# EAGLE board SegmentDriver (EAGLE 7.7.0)
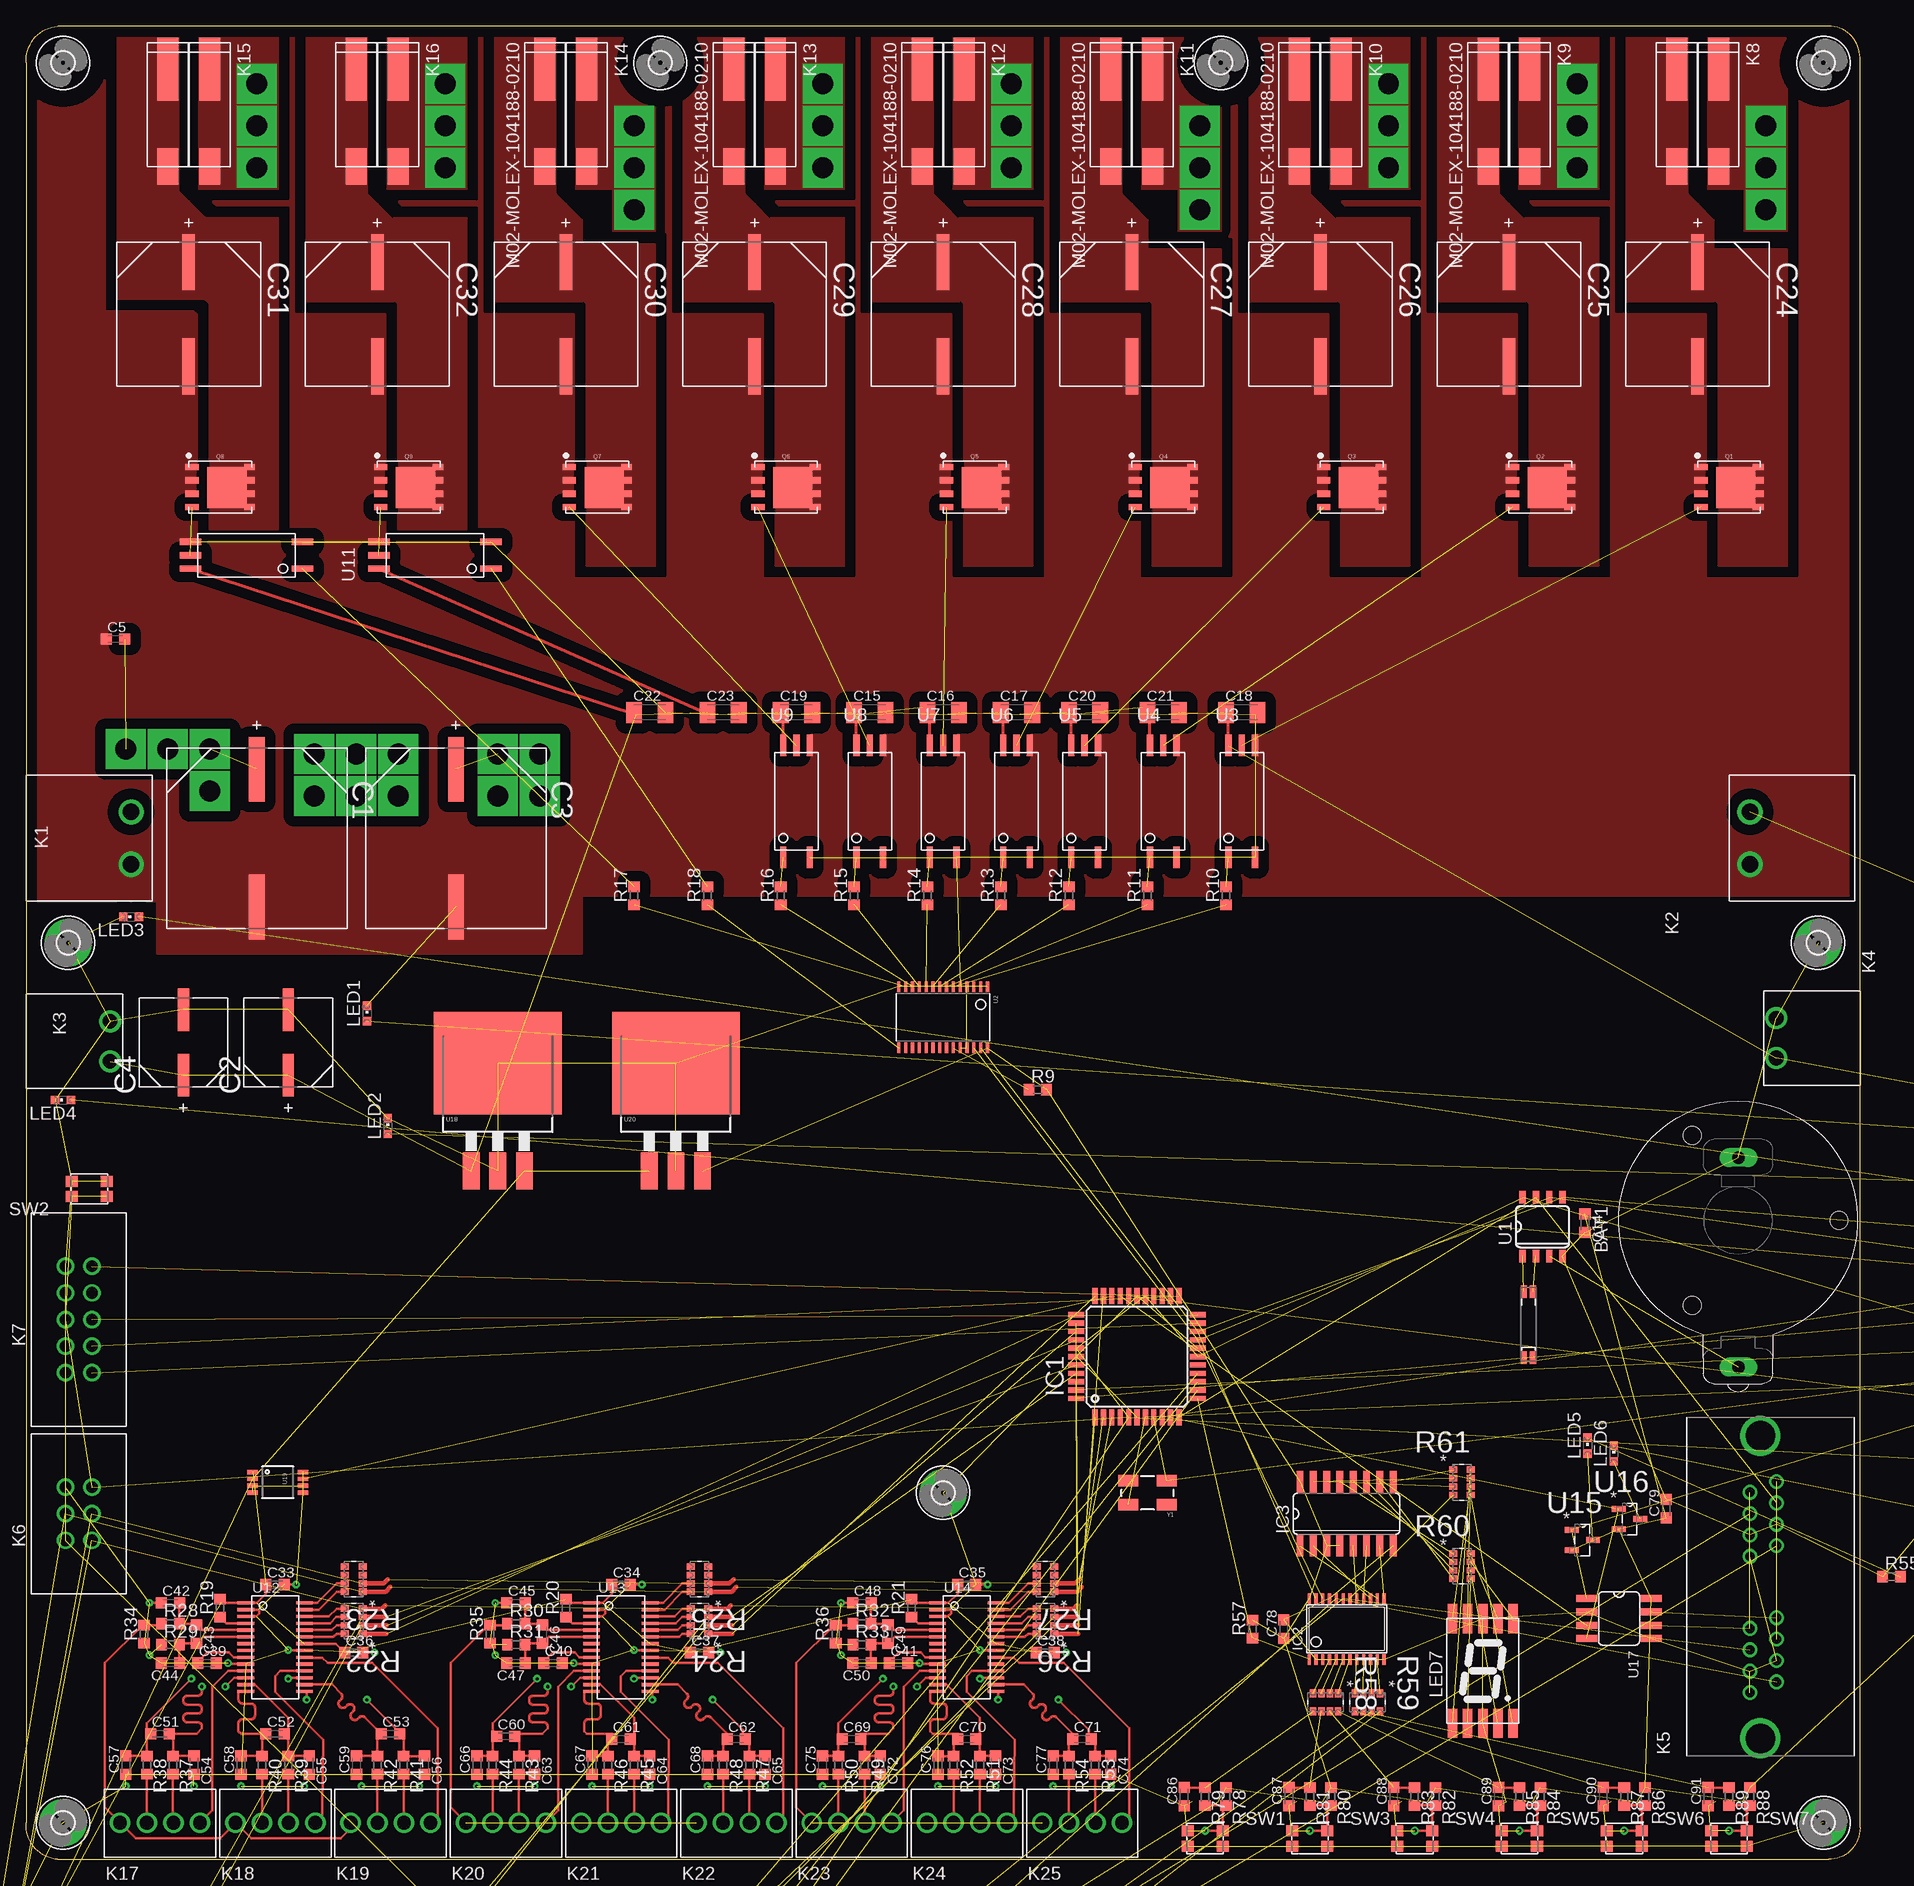
[diagram p10: board, top side]
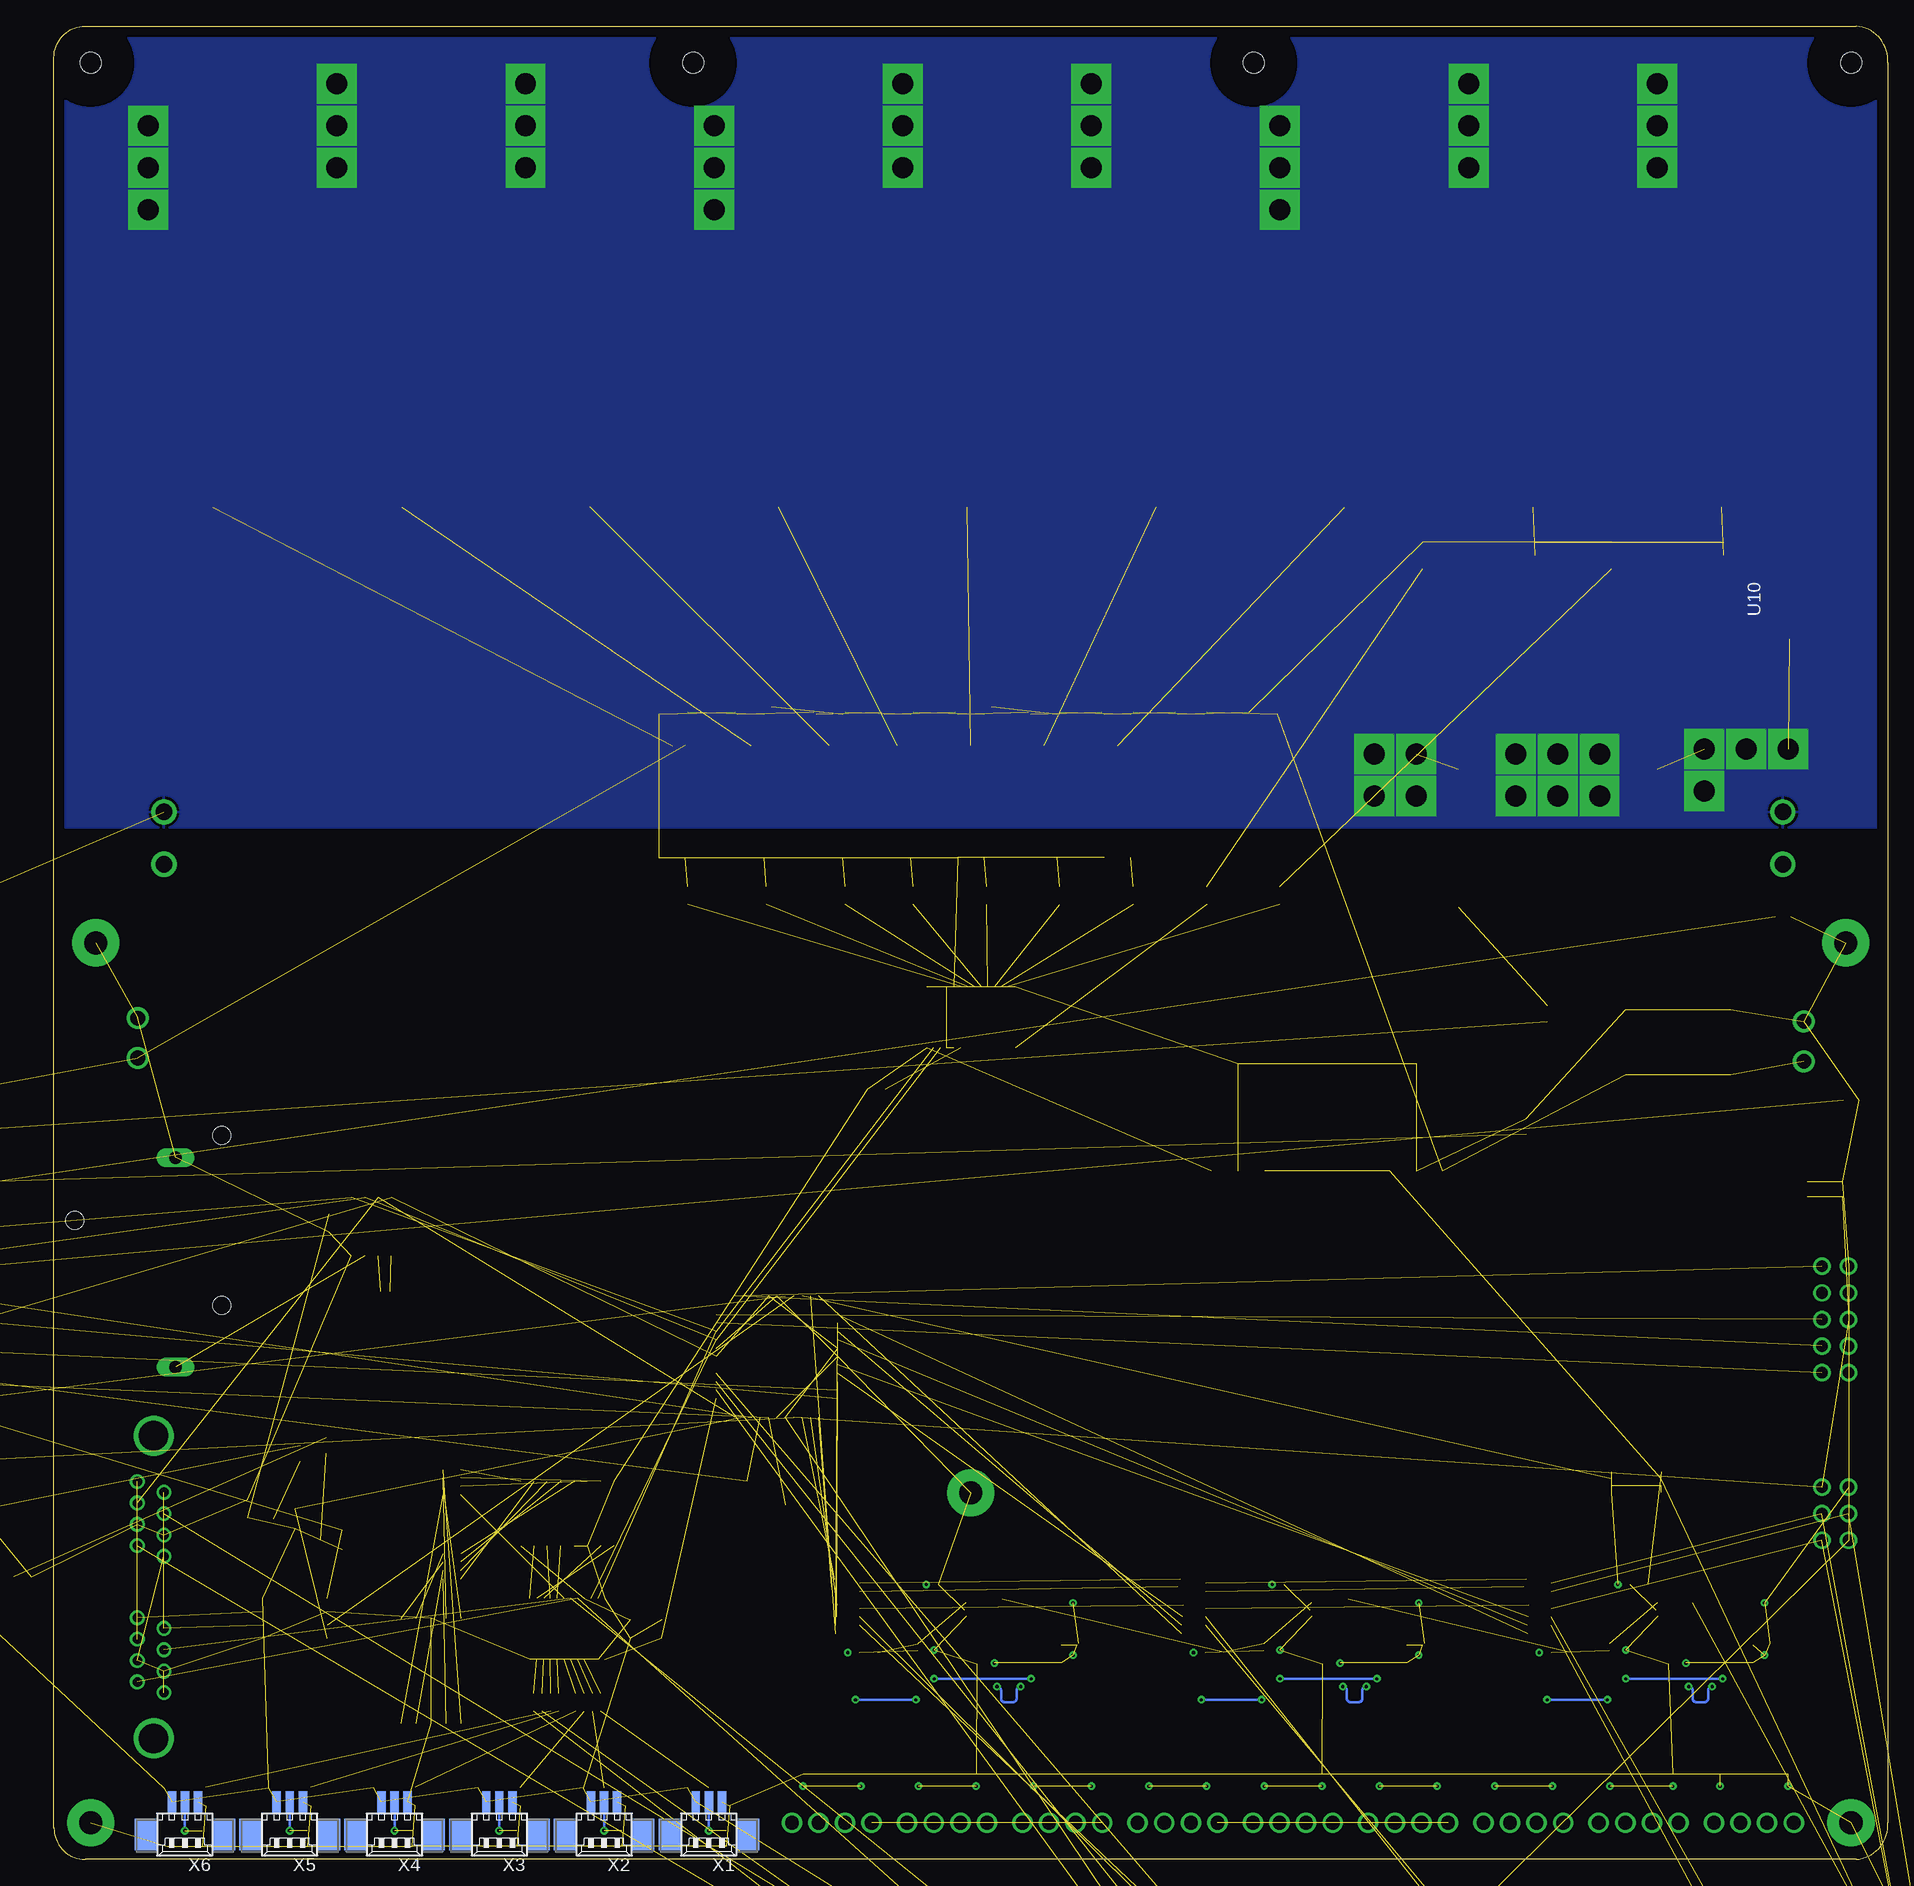
[diagram p11: board, bottom side, seen from below]

Size 175.01 x 175 mm. Coordinates in mm from the lower left corner, seen from the top.
Outline: 3.01,0 172.01,0 arc90 175.01,3 175.01,172 arc90 172.01,175 3.01,175 arc90 0.01,171.5 0.01,3.5 arc90 3.01,0
Copper layers (1*16): Top 0.035mm / dielectric 1.5mm / Bottom 0.035mm
Design rules "default": minimum track width 10mil, minimum drill 0.6mm, track to track 8mil, track to pad 8mil, pad to pad 8mil, via to via 8mil, smd to smd 8mil, copper to edge 40mil, drill to drill 8mil, minimum pad ring 10mil, minimum via ring 8mil, stop-mask expansion 4mil, vias tented up to drill 0mil, thermal gap 10mil
Net classes: 2 PWR: drill 0.4 mm

## Footprints (pad centres in the part's own frame; a part is rotated, then mirrored left to right if it is on the bottom)
2,0 = hole 2: 0,0
79528211 = drill 1.2 long: + -14,0; - 6,0 | hole 1.7: 0,-9.6; -8.1,4.4; 8.1,4.4
CAPAE1700X1700N = smd 6.172 x 1.499: 1 -6.579,0; 2 6.579,0
CAPAE830X1050N = smd 4.064 x 1.092: 1 -3.124,0; 2 3.124,0
C0603K = smd 1.05 x 1.08: 1 -0.875,0; 2 0.875,0
C1206K = smd 1.5 x 2: 1 -1.5,0; 2 1.5,0
CAPAE1350X1400N = smd 5.359 x 1.194: 1 -4.978,0; 2 4.978,0
C0805K = smd 1.3 x 1.6: 1 -1,0; 2 1,0
2,0-PAD = drill 2.2 pad 4.5: B2,2 0,0
TQFP44 = smd 1.5 x 0.5: 1 -5.8,4; 2 -5.8,3.2; 3 -5.8,2.4; 4 -5.8,1.6; 5 -5.8,0.8; 6 -5.8,0; 7 -5.8,-0.8; 8 -5.8,-1.6; 9 -5.8,-2.4; 10 -5.8,-3.2; 11 -5.8,-4; 23 5.8,-4; 24 5.8,-3.2; 25 5.8,-2.4; 26 5.8,-1.6; 27 5.8,-0.8; 28 5.8,0; 29 5.8,0.8; 30 5.8,1.6; 31 5.8,2.4; 32 5.8,3.2; 33 5.8,4 | smd 0.5 x 1.5: 12 -4,-5.8; 13 -3.2,-5.8; 14 -2.4,-5.8; 15 -1.6,-5.8; 16 -0.8,-5.8; 17 0,-5.8; 18 0.8,-5.8; 19 1.6,-5.8; 20 2.4,-5.8; 21 3.2,-5.8; 22 4,-5.8; 34 4,5.8; 35 3.2,5.8; 36 2.4,5.8; 37 1.6,5.8; 38 0.8,5.8; 39 0,5.8; 40 -0.8,5.8; 41 -1.6,5.8; 42 -2.4,5.8; 43 -3.2,5.8; 44 -4,5.8
TSSOP24 = smd 0.305 x 0.991: 1 -3.575,-2.918; 2 -2.925,-2.918; 3 -2.275,-2.918; 4 -1.625,-2.918; 5 -0.975,-2.918; 6 -0.325,-2.918; 7 0.325,-2.918; 8 0.975,-2.918; 9 1.625,-2.918; 10 2.275,-2.918; 11 2.925,-2.918; 12 3.575,-2.918; 13 3.575,2.918; 14 2.925,2.918; 15 2.275,2.918; 16 1.625,2.918; 17 0.975,2.918; 18 0.325,2.918; 19 -0.325,2.918; 20 -0.975,2.918; 21 -1.625,2.918; 22 -2.275,2.918; 23 -2.925,2.918; 24 -3.575,2.918
SO16 = smd 0.66 x 2.032: 1 -4.445,-3.073; 2 -3.175,-3.073; 3 -1.905,-3.073; 4 -0.635,-3.073; 5 0.635,-3.073; 6 1.905,-3.073; 7 3.175,-3.073; 8 4.445,-3.073; 9 4.445,3.073; 10 3.175,3.073; 11 1.905,3.073; 12 0.635,3.073; 13 -0.635,3.073; 14 -1.905,3.073; 15 -3.175,3.073; 16 -4.445,3.073
2X3 = drill 1.016 pad 1.88 octagon: 1 0,0; 2 0,2.54; 3 2.54,0; 4 2.54,2.54; 5 5.08,0; 6 5.08,2.54
691313710002 = drill 1.6: 1 -5,0; 2 0,0
691322310002 = drill 1.4: 1 -3.81,0; 2 0,0
615016149521 = drill 0.9: A1 -2.93,-1.54; A2 -3.95,1; A3 -4.97,-1.54; A4 -5.99,1; A5 -7.01,-1.54; A6 -8.03,1; A7 -9.05,-1.54; A8 -10.07,1; B1 10.07,-1.54; B2 9.05,1; B3 8.03,-1.54; B4 7.01,1; B5 5.99,-1.54; B6 4.97,1; B7 3.95,-1.54; B8 2.93,1 | drill 2.8: Z1 -14.45,0; Z2 14.45,0
61200621621 = drill 1.1: 1 -2.54,-1.27; 2 -2.54,1.27; 3 0,-1.27; 4 0,1.27; 5 2.54,-1.27; 6 2.54,1.27
61201021621 = drill 1.1: 1 -2.54,-1.27; 2 -2.54,1.27; 3 0,-1.27; 4 0,1.27; 5 2.54,-1.27; 6 2.54,1.27; 7 5.08,-1.27; 8 5.08,1.27; 9 7.62,-1.27; 10 7.62,1.27
LITE-TRAP-CONNECTOR-2 = smd 6 x 2: 1A -3.4,-2; 2A -3.4,2 | smd 3.5 x 2: 1B 5.9,-2; 2B 5.9,2
691210910004 = drill 1.3: 1 -2.54,0; 2 0,0; 3 2.54,0; 4 5.08,0
CHIPLED_0603 = smd 0.8 x 0.8: A 0,-0.75; C 0,0.75
SA02107 = smd 0.9 x 2.8: A@7 1.44,5; B@6 2.88,5; C@4 1.44,-5; COM@3 0,-5; COM@8 0,5; D@2 -1.44,-5; DP@5 2.88,-5; E@1 -2.88,-5; F@9 -1.44,5; G@10 -2.88,5
POWERPACK5060-8 = smd 1.02 x 0.61: D5 2.79,-1.905; D8 2.79,1.905 | smd 0.77 x 0.61: D6 2.915,-0.635; D7 2.915,0.635 | smd 3.75 x 3.91: DPAD 0.65,-0.05 | smd 1.27 x 0.61: G4 -2.675,-1.905; S1 -2.675,1.905; S2 -2.675,0.635; S3 -2.675,-0.635
R0603 = smd 1 x 1.1: 1 -0.85,0; 2 0.85,0
RESCAV80P320X160X70-8N = smd 0.762 x 0.61: 1 -0.838,1.194; 2 -0.838,0.406; 3 -0.838,-0.406; 4 -0.838,-1.194; 5 0.838,-1.194; 6 0.838,-0.406; 7 0.838,0.406; 8 0.838,1.194
434153017835 = smd 1.15 x 1.05: 1 -1.675,0.725; 2 -1.675,-0.725; 3 1.675,0.725; 4 1.675,-0.725
SO08-TIGHT = smd 0.6 x 1.2: 1 -1.905,-2.8; 2 -0.635,-2.8; 3 0.635,-2.8; 4 1.905,-2.8; 5 1.905,2.8; 6 0.635,2.8; 7 -0.635,2.8; 8 -1.905,2.8
TSSOP28 = smd 0.305 x 0.991: 1 -4.225,-2.918; 2 -3.575,-2.918; 3 -2.925,-2.918; 4 -2.275,-2.918; 5 -1.625,-2.918; 6 -0.975,-2.918; 7 -0.325,-2.918; 8 0.325,-2.918; 9 0.975,-2.918; 10 1.625,-2.918; 11 2.275,-2.918; 12 2.925,-2.918; 13 3.575,-2.918; 14 4.225,-2.918; 15 4.225,2.918; 16 3.575,2.918; 17 2.925,2.918; 18 2.275,2.918; 19 1.625,2.918; 20 0.975,2.918; 21 0.325,2.918; 22 -0.325,2.918; 23 -0.975,2.918; 24 -1.625,2.918; 25 -2.275,2.918; 26 -2.925,2.918; 27 -3.575,2.918; 28 -4.225,2.918
WB-SOP5 = smd 0.6 x 2.05: 1 -1.27,-5.35; 3 1.27,-5.35; 4 1.27,5.35; 5 0,5.35; 6 -1.27,5.35
TSSOP28' = smd 0.3 x 1.6: 1 -4.25,-2.8; 2 -3.6,-2.8; 3 -2.95,-2.8; 4 -2.3,-2.8; 5 -1.65,-2.8; 6 -1,-2.8; 7 -0.35,-2.8; 8 0.3,-2.8; 9 0.95,-2.8; 10 1.6,-2.8; 11 2.25,-2.8; 12 2.9,-2.8; 13 3.55,-2.8; 14 4.2,-2.8; 15 4.2,2.8; 16 3.55,2.8; 17 2.9,2.8; 18 2.25,2.8; 19 1.6,2.8; 20 0.95,2.8; 21 0.3,2.8; 22 -0.35,2.8; 23 -1,2.8; 24 -1.65,2.8; 25 -2.3,2.8; 26 -2.95,2.8; 27 -3.6,2.8; 28 -4.25,2.8
SOT95P240X110-3N = smd 1.321 x 0.559: 1 -1.016,0.965; 2 -1.016,-0.965; 3 1.016,0
SOIC08 = smd 0.66 x 2.032: 1 -1.905,-3.073; 2 -0.635,-3.073; 3 0.635,-3.073; 4 1.905,-3.073; 5 1.905,3.073; 6 0.635,3.073; 7 -0.635,3.073; 8 -1.905,3.073
D2PACK/A = smd 1.6 x 3.5: 1 -2.54,-8.275; 2 0,-8.275; 3 2.54,-8.275 | smd 12.2 x 9.75: TAB 0,2
MSOP-8 = smd 0.41 x 1.02: 1 -0.975,-2.4; 2 -0.325,-2.4; 3 0.325,-2.4; 4 0.975,-2.4; 5 0.975,2.4; 6 0.325,2.4; 7 -0.325,2.4; 8 -0.975,2.4
53261-03 = smd 0.8 x 2: 1 1.25,-2.5; 2 0,-2.5; 3 -1.25,-2.5 | smd 2.1 x 3: S1 3.75,0.625; S2 -3.75,0.625
CRYSTAL-SMD-5X3 = smd 1.9 x 1.1: 1 -1.85,-1.15; 2 1.85,-1.15; 3 1.85,1.15; 4 -1.85,1.15
CRYSTAL-32KHZ-SMD_EPSON_MC146 = smd 1.2 x 0.6: NC1 6.9,1.2; NC2 6.9,0.3; P$1 0.6,0.3; P$2 0.6,1.2

## Placement (x,y rotation side)
$2_206_$_2016-11-07_20-18-07  MOUNT-HOLE2.0  [2,0]  3.51,171.5 0 top
BAT1  [79528211]  163.41,61 90 top
C1  470UF  [CAPAE1700X1700N]  22.01,97.5 270 top
C2  220UF  [CAPAE830X1050N]  25.01,78 90 top
C3  470UF  [CAPAE1700X1700N]  41.01,97.5 270 top
C4  220UF  [CAPAE830X1050N]  15.01,78 90 top
C5  0.1uF  [C0603K]  8.51,116.5 0 top
C6  0.1uF  [C0603K]  250.51,61.5 0 top  (outside the outline)
C7  0.1uF  [C0603K]  255.01,49 90 top  (outside the outline)
C8  0.1uF  [C0603K]  255.01,55 90 top  (outside the outline)
C9  0.1uF  [C0603K]  255.01,61 90 top  (outside the outline)
C10  0.1uF  [C0603K]  235.01,42.5 90 top  (outside the outline)
C11  12pF  [C0603K]  235.01,48.5 90 top  (outside the outline)
C12  12pF  [C0603K]  235.01,53.5 90 top  (outside the outline)
C13  0.1uF  [C0603K]  235.01,36.5 90 top  (outside the outline)
C14  0.1uF  [C0603K]  148.76,60.75 270 top
C15  0.1uF  [C1206K]  80.51,109.5 0 top
C16  0.1uF  [C1206K]  87.51,109.5 0 top
C17  0.1uF  [C1206K]  94.51,109.5 0 top
C18  0.1uF  [C1206K]  116.01,109.5 0 top
C19  0.1uF  [C1206K]  73.51,109.5 0 top
C20  0.1uF  [C1206K]  101.01,109.5 0 top
C21  0.1uF  [C1206K]  108.51,109.5 0 top
C22  0.1uF  [C1206K]  59.51,109.5 0 top
C23  0.1uF  [C1206K]  66.51,109.5 0 top
C24  220UF  [CAPAE1350X1400N]  159.51,147.5 270 top
C25  220UF  [CAPAE1350X1400N]  141.51,147.5 270 top
C26  220UF  [CAPAE1350X1400N]  123.51,147.5 270 top
C27  220UF  [CAPAE1350X1400N]  105.51,147.5 270 top
C28  220UF  [CAPAE1350X1400N]  87.51,147.5 270 top
C29  220UF  [CAPAE1350X1400N]  69.51,147.5 270 top
C30  220UF  [CAPAE1350X1400N]  51.51,147.5 270 top
C31  220UF  [CAPAE1350X1400N]  15.51,147.5 270 top
C32  220UF  [CAPAE1350X1400N]  33.51,147.5 270 top
C33  0.1uF  [C0603K]  23.76,26.25 0 top
C34  0.1uF  [C0603K]  56.76,26.25 0 top
C35  0.1uF  [C0603K]  89.76,26.25 0 top
C36  0.1uF  [C0603K]  31.26,19.75 0 top
C37  0.1uF  [C0603K]  64.26,19.75 0 top
C38  0.1uF  [C0603K]  97.26,19.75 0 top
C39  1uF  [C0603K]  17.26,18.75 0 top
C40  1uF  [C0603K]  50.26,18.75 0 top
C41  1uF  [C0603K]  83.26,18.75 0 top
C42  0.1uF  [C0603K]  13.76,24.5 0 top
C43  0.1uF  [C0603K]  16.26,21.5 270 top
C44  0.1uF  [C0603K]  13.76,18.75 180 top
C45  0.1uF  [C0603K]  46.76,24.5 0 top
C46  0.1uF  [C0603K]  49.26,21.5 270 top
C47  0.1uF  [C0603K]  46.76,18.75 180 top
C48  0.1uF  [C0603K]  79.76,24.5 0 top
C49  0.1uF  [C0603K]  82.26,21.5 270 top
C50  0.1uF  [C0603K]  79.76,18.75 180 top
C51  0.1uF  [C0603K]  12.76,12 0 top
C52  0.1uF  [C0603K]  23.76,12 0 top
C53  0.1uF  [C0603K]  34.76,12 0 top
C54  0.1uF  [C0603K]  16.01,9 270 top
C55  0.1uF  [C0603K]  27.01,9 270 top
C56  0.1uF  [C0603K]  38.01,9 270 top
C57  0.1uF  [C0603K]  9.51,9 90 top
C58  0.1uF  [C0603K]  20.51,9 90 top
C59  0.1uF  [C0603K]  31.51,9 90 top
C60  0.1uF  [C0603K]  45.76,11.75 0 top
C61  0.1uF  [C0603K]  56.76,11.5 0 top
C62  0.1uF  [C0603K]  67.76,11.5 0 top
C63  0.1uF  [C0603K]  48.51,9 270 top
C64  0.1uF  [C0603K]  59.51,9 270 top
C65  0.1uF  [C0603K]  70.51,9 270 top
C66  0.1uF  [C0603K]  43.01,9 90 top
C67  0.1uF  [C0603K]  54.01,9 90 top
C68  0.1uF  [C0603K]  65.01,9 90 top
C69  0.1uF  [C0603K]  78.76,11.5 0 top
C70  0.1uF  [C0603K]  89.76,11.5 0 top
C71  0.1uF  [C0603K]  100.76,11.5 0 top
C72  0.1uF  [C0603K]  81.51,9 270 top
C73  0.1uF  [C0603K]  92.51,9 270 top
C74  0.1uF  [C0603K]  103.51,9 270 top
C75  0.1uF  [C0603K]  76.01,9 90 top
C76  0.1uF  [C0603K]  87.01,9 90 top
C77  0.1uF  [C0603K]  98.01,9 90 top
C78  0.1uF  [C0603K]  120.01,22 90 top
C79  0.1uF  [C0603K]  156.51,33.5 90 top
C80  0.1uF  [C0603K]  186.01,26 0 top  (outside the outline)
C81  4.7uF  [C0603K]  -18.99,-43 0 top  (outside the outline)
C82  4.7uF  [C0805K]  -18.99,-48 0 top  (outside the outline)
C83  4.7uF  [C0805K]  -18.99,-54 0 top  (outside the outline)
C84  4.7uF  [C0603K]  -18.99,-59 0 top  (outside the outline)
C85  4.7uF  [C0805K]  -18.99,-64 0 top  (outside the outline)
C86  1uF  [C0603K]  110.51,6 90 top
C87  1uF  [C0603K]  120.51,6 90 top
C88  1uF  [C0603K]  130.51,6 90 top
C89  1uF  [C0603K]  140.51,6 90 top
C90  1uF  [C0603K]  150.51,6 90 top
C91  1uF  [C0603K]  160.51,6 90 top
H1  MOUNT-PAD-ROUND2,0  [2,0-PAD]  87.51,35 0 top
H2  MOUNT-PAD-ROUND2,0  [2,0-PAD]  171.51,3.5 0 top
H3  MOUNT-PAD-ROUND2,0  [2,0-PAD]  3.51,3.5 0 top
H4  MOUNT-PAD-ROUND2,0  [2,0-PAD]  171.01,87.5 0 top
H5  MOUNT-PAD-ROUND2,0  [2,0-PAD]  4.01,87.5 0 top
H6  MOUNT-HOLE2.0  [2,0]  171.51,171.5 0 top
H7  MOUNT-HOLE2.0  [2,0]  60.51,171.5 0 top
H8  MOUNT-HOLE2.0  [2,0]  114.01,171.5 0 top
IC1  ATMEGA644A  [TQFP44]  106.01,48 90 top
IC2  PCA9555PW  [TSSOP24]  126.01,22 0 top
IC3  4511D  [SO16]  126.01,33 0 top
JP1  [2X3]  -10.99,-124 0 top  (outside the outline)
K1  691313710002  [691313710002]  10.01,95 270 top
K2  691313710002  [691313710002]  164.51,100 90 top
K3  691322310002  [691322310002]  8.01,80 90 top
K4  691322310002  [691322310002]  167.01,76.5 270 top
K5  [615016149521]  165.51,26 90 top
K6  61200621621  [61200621621]  5.01,33 90 top
K7  61201021621  [61201021621]  5.01,49 90 top
K8  M02-MOLEX-104188-0210  [LITE-TRAP-CONNECTOR-2]  159.51,167.5 270 top
K9  M02-MOLEX-104188-0210  [LITE-TRAP-CONNECTOR-2]  141.51,167.5 270 top
K10  M02-MOLEX-104188-0210  [LITE-TRAP-CONNECTOR-2]  123.51,167.5 270 top
K11  M02-MOLEX-104188-0210  [LITE-TRAP-CONNECTOR-2]  105.51,167.5 270 top
K12  M02-MOLEX-104188-0210  [LITE-TRAP-CONNECTOR-2]  87.51,167.5 270 top
K13  M02-MOLEX-104188-0210  [LITE-TRAP-CONNECTOR-2]  69.51,167.5 270 top
K14  M02-MOLEX-104188-0210  [LITE-TRAP-CONNECTOR-2]  51.51,167.5 270 top
K15  M02-MOLEX-104188-0210  [LITE-TRAP-CONNECTOR-2]  15.51,167.5 270 top
K16  M02-MOLEX-104188-0210  [LITE-TRAP-CONNECTOR-2]  33.51,167.5 270 top
K17  691210910004  [691210910004]  11.51,3.5 0 top
K18  691210910004  [691210910004]  22.51,3.5 0 top
K19  691210910004  [691210910004]  33.51,3.5 0 top
K20  691210910004  [691210910004]  44.51,3.5 0 top
K21  691210910004  [691210910004]  55.51,3.5 0 top
K22  691210910004  [691210910004]  66.51,3.5 0 top
K23  691210910004  [691210910004]  77.51,3.5 0 top
K24  691210910004  [691210910004]  88.51,3.5 0 top
K25  691210910004  [691210910004]  99.51,3.5 0 top
LED1  [CHIPLED_0603]  32.51,80.75 0 top
LED2  [CHIPLED_0603]  34.51,70 0 top
LED3  [CHIPLED_0603]  10.01,90 90 top
LED4  [CHIPLED_0603]  3.51,72.5 90 top
LED5  AMBER  [CHIPLED_0603]  149.01,39.5 0 top
LED6  AMBER  [CHIPLED_0603]  151.51,38.75 0 top
LED7  7-SEG_SA02-107  [SA02107]  139.01,18 0 top
Q1  MOSFET-NCHANNEL-FDMS5672  [POWERPACK5060-8]  162.51,131 0 top
Q2  MOSFET-NCHANNEL-FDMS5672  [POWERPACK5060-8]  144.51,131 0 top
Q3  MOSFET-NCHANNEL-FDMS5672  [POWERPACK5060-8]  126.51,131 0 top
Q4  MOSFET-NCHANNEL-FDMS5672  [POWERPACK5060-8]  108.51,131 0 top
Q5  MOSFET-NCHANNEL-FDMS5672  [POWERPACK5060-8]  90.51,131 0 top
Q6  MOSFET-NCHANNEL-FDMS5672  [POWERPACK5060-8]  72.51,131 0 top
Q7  MOSFET-NCHANNEL-FDMS5672  [POWERPACK5060-8]  54.51,131 0 top
Q8  MOSFET-NCHANNEL-FDMS5672  [POWERPACK5060-8]  18.51,131 0 top
Q9  MOSFET-NCHANNEL-FDMS5672  [POWERPACK5060-8]  36.51,131 0 top
R1  2K4  [R0603]  244.01,65.5 0 top  (outside the outline)
R2  1.2K  [R0603]  238.51,63 0 top  (outside the outline)
R3  10k  [R0603]  230.01,36.5 90 top  (outside the outline)
R4  1k  [R0603]  245.01,62 90 top  (outside the outline)
R5  4.7k  [R0603]  245.01,50 90 top  (outside the outline)
R6  4.7k  [R0603]  245.01,56 90 top  (outside the outline)
R7  1k  [R0603]  230.01,56.5 90 top  (outside the outline)
R8  1k  [R0603]  230.01,51.5 90 top  (outside the outline)
R9  10k  [R0603]  96.53,73.49 0 top
R10  330  [R0603]  114.51,92 90 top
R11  330  [R0603]  107.01,92 90 top
R12  330  [R0603]  99.51,92 90 top
R13  330  [R0603]  93.01,92 90 top
R14  330  [R0603]  86.01,92 90 top
R15  330  [R0603]  79.01,92 90 top
R16  330  [R0603]  72.01,92 90 top
R17  330  [R0603]  58.01,92 90 top
R18  330  [R0603]  65.01,92 90 top
R19  100k  [R0603]  18.51,24 90 top
R20  100k  [R0603]  51.51,24 90 top
R21  100k  [R0603]  84.51,24 90 top
R22  33R  [RESCAV80P320X160X70-8N]  31.26,22.75 180 top
R23  33R  [RESCAV80P320X160X70-8N]  31.26,26.75 180 top
R24  33R  [RESCAV80P320X160X70-8N]  64.26,22.75 180 top
R25  33R  [RESCAV80P320X160X70-8N]  64.26,26.75 180 top
R26  33R  [RESCAV80P320X160X70-8N]  97.26,22.75 180 top
R27  33R  [RESCAV80P320X160X70-8N]  97.26,26.75 180 top
R28  100k  [R0603]  13.76,22.5 0 top
R29  100k  [R0603]  13.76,20.5 0 top
R30  100k  [R0603]  46.76,22.5 0 top
R31  100k  [R0603]  46.76,20.5 0 top
R32  100k  [R0603]  79.76,22.5 0 top
R33  100k  [R0603]  79.76,20.5 0 top
R34  100k  [R0603]  11.26,21.5 90 top
R35  100k  [R0603]  44.26,21.5 90 top
R36  100k  [R0603]  77.26,21.5 90 top
R37  0R  [R0603]  14.01,9 270 top
R38  0R  [R0603]  11.51,9 270 top
R39  0R  [R0603]  25.01,9 270 top
R40  0R  [R0603]  22.51,9 270 top
R41  0R  [R0603]  36.01,9 270 top
R42  0R  [R0603]  33.51,9 270 top
R43  0R  [R0603]  47.01,9 270 top
R44  0R  [R0603]  44.51,9 270 top
R45  0R  [R0603]  58.01,9 270 top
R46  0R  [R0603]  55.51,9 270 top
R47  0R  [R0603]  69.01,9 270 top
R48  0R  [R0603]  66.51,9 270 top
R49  0R  [R0603]  80.01,9 270 top
R50  0R  [R0603]  77.51,9 270 top
R51  0R  [R0603]  91.01,9 270 top
R52  0R  [R0603]  88.51,9 270 top
R53  0R  [R0603]  102.01,9 270 top
R54  0R  [R0603]  99.51,9 270 top
R55  1k  [R0603]  178.01,27 0 top
R56  1k  [R0603]  183.01,33 0 top  (outside the outline)
R57  10k  [R0603]  117.01,22 90 top
R58  47R  [RESCAV80P320X160X70-8N]  124.01,15 270 top
R59  47R  [RESCAV80P320X160X70-8N]  128.01,15 270 top
R60  47R  [RESCAV80P320X160X70-8N]  137.01,28 0 top
R61  1k  [RESCAV80P320X160X70-8N]  137.01,36 0 top
R62  100k  [R0603]  -18.99,-69 0 top  (outside the outline)
R63  100k  [R0603]  -18.99,-74 0 top  (outside the outline)
R64  100k  [R0603]  -18.99,-79 0 top  (outside the outline)
R65  100k  [R0603]  -18.99,-84 0 top  (outside the outline)
R66  100k  [R0603]  -18.99,-89 0 top  (outside the outline)
R67  100k  [R0603]  -18.99,-94 0 top  (outside the outline)
R68  100k  [R0603]  -18.99,-99 0 top  (outside the outline)
R69  100k  [R0603]  -18.99,-104 0 top  (outside the outline)
R70  100k  [R0603]  -18.99,-109 0 top  (outside the outline)
R71  100k  [R0603]  54.01,-20 90 top  (outside the outline)
R72  100k  [R0603]  59.01,-20 90 top  (outside the outline)
R73  100k  [R0603]  64.01,-20 90 top  (outside the outline)
R74  10k  [R0603]  69.01,-20 90 top  (outside the outline)
R75  10k  [R0603]  74.01,-20 90 top  (outside the outline)
R76  120  [R0603]  79.01,-20 90 top  (outside the outline)
R77  120  [R0603]  84.01,-20 90 top  (outside the outline)
R78  69k  [R0603]  114.51,6 270 top
R79  18k  [R0603]  112.51,6 270 top
R80  69k  [R0603]  124.51,6 270 top
R81  18k  [R0603]  122.51,6 270 top
R82  69k  [R0603]  134.51,6 270 top
R83  18k  [R0603]  132.51,6 270 top
R84  69k  [R0603]  144.51,6 270 top
R85  18k  [R0603]  142.51,6 270 top
R86  69k  [R0603]  154.51,6 270 top
R87  18k  [R0603]  152.51,6 270 top
R88  69k  [R0603]  164.51,6 270 top
R89  18k  [R0603]  162.51,6 270 top
SW1  [434153017835]  112.51,2 0 top
SW2  [434153017835]  6.01,64 180 top
SW3  [434153017835]  122.51,2 0 top
SW4  [434153017835]  132.51,2 0 top
SW5  [434153017835]  142.51,2 0 top
SW6  [434153017835]  152.51,2 0 top
SW7  [434153017835]  162.51,2 0 top
U1  DS1307SO8-TIGHT  [SO08-TIGHT]  144.71,60.4 0 top
U2  [TSSOP28]  87.51,80.4 180 top
U3  FOD8321  [WB-SOP5]  116.01,101 0 top
U4  FOD8321  [WB-SOP5]  108.51,101 0 top
U5  FOD8321  [WB-SOP5]  101.01,101 0 top
U6  FOD8321  [WB-SOP5]  94.51,101 0 top
U7  FOD8321  [WB-SOP5]  87.51,101 0 top
U8  FOD8321  [WB-SOP5]  80.51,101 0 top
U9  FOD8321  [WB-SOP5]  73.51,101 0 top
U10  FOD8321  [WB-SOP5]  21.01,124.5 90 top
U11  FOD8321  [WB-SOP5]  39.01,124.5 90 top
U12  [TSSOP28']  23.76,20.25 270 top
U13  [TSSOP28']  56.76,20.25 270 top
U14  [TSSOP28']  89.76,20.25 270 top
U15  DMP2215L-7  [SOT95P240X110-3N]  148.51,30.5 0 top
U16  DMP2215L-7  [SOT95P240X110-3N]  153.01,32.5 0 top
U17  [SOIC08]  152.01,23 270 top
U18  7808  [D2PACK/A]  45.01,74 0 top
U19  ADP3333ARM-5  [MSOP-8]  24.01,36 270 top
U20  7805  [D2PACK/A]  62.01,74 0 top
X1  53261-03  [53261-03]  112.51,3 180 bottom
X2  53261-03  [53261-03]  122.51,3 180 bottom
X3  53261-03  [53261-03]  132.51,3 180 bottom
X4  53261-03  [53261-03]  142.51,3 180 bottom
X5  53261-03  [53261-03]  152.51,3 180 bottom
X6  53261-03  [53261-03]  162.51,3 180 bottom
Y1  [CRYSTAL-SMD-5X3]  107.01,35 180 top
Y2  32.768kHz  [CRYSTAL-32KHZ-SMD_EPSON_MC146]  142.61,54.8 270 top

## Tracks (layer width: path | path; a pad name or v marks a point on that pad's centre or on a via)
5V  (18 unrouted)
9_AD1
  Top 0.254: C39.1 16.38,18.88 17.26,19.75 19.35,19.75 19.79,19.31 U12.9
9_AD2
  Top 0.254: C40.1 49.38,18.88 50.26,19.75 52.35,19.75 52.79,19.31 U13.9
9_AD3
  Top 0.254: C41.1 82.38,18.88 83.26,19.75 85.35,19.75 85.79,19.31 U14.9
23_AD1
  Top 0.254: R22.8 29.62,21.56 29.31,21.25 U12.23
23_AD2
  Top 0.254: R24.8 62.62,21.56 62.31,21.25 U13.23
23_AD3
  Top 0.254: R26.8 95.62,21.56 95.31,21.25 U14.23
24_AD1
  Top 0.254: R22.7 29.62,22.34 29.18,21.9 U12.24
24_AD2
  Top 0.254: R24.7 62.62,22.34 62.18,21.9 U13.24
24_AD3
  Top 0.254: R26.7 95.62,22.34 95.18,21.9 U14.24
25_AD1
  Top 0.254: R22.6 29.61,23.16 | 29.61,23.16 29.87,23.16 | U12.25 29,22.55 29.61,23.16
25_AD2
  Top 0.254: R24.6 62.61,23.16 | 62.61,23.16 62.87,23.16 | U13.25 62,22.55 62.61,23.16
25_AD3
  Top 0.254: R26.6 95.61,23.16 | 95.61,23.16 95.87,23.16 | U14.25 95,22.55 95.61,23.16
26_AD1
  Top 0.254: R22.5 29.62,23.94 28.88,23.2 U12.26
26_AD2
  Top 0.254: R24.5 62.62,23.94 61.88,23.2 U13.26
26_AD3
  Top 0.254: R26.5 95.62,23.94 94.88,23.2 U14.26
27_AD1
  Top 0.254: R23.8 29.62,25.55 27.92,23.85 U12.27
27_AD2
  Top 0.254: R25.8 62.62,25.55 60.92,23.85 U13.27
27_AD3
  Top 0.254: R27.8 95.62,25.55 93.92,23.85 U14.27
28_AD1
  Top 0.254: R23.7 29.62,26.34 27.78,24.5 U12.28
28_AD2
  Top 0.254: R25.7 62.62,26.34 60.78,24.5 U13.28
28_AD3
  Top 0.254: R27.7 95.62,26.34 93.78,24.5 U14.28
!ADCSUP_SD  (1 unrouted)
!CS!_AD1  (2 unrouted)
  Top 0.406: R22.2 34.39,22.34
!CS!_AD2  (2 unrouted)
  Top 0.406: R24.2 67.39,22.34
!CS!_AD3  (2 unrouted)
  Top 0.406: R26.2 100.39,22.34
!DRDY!_AD1  (2 unrouted)
  Top 0.406: R22.3 34.3,23.16
!DRDY!_AD2  (2 unrouted)
  Top 0.406: R24.3 67.3,23.16
!DRDY!_AD3  (2 unrouted)
  Top 0.406: R26.3 100.3,23.16
!RESET  (5 unrouted)
!RESET!_AD1
  Top 0.254: U12.4 19.11,22.55 R19.1
!RESET!_AD2
  Top 0.254: U13.4 52.11,22.55 R20.1
!RESET!_AD3
  Top 0.254: U14.4 85.11,22.55 R21.1
+5V  (29 unrouted)
+8V  (5 unrouted)
+15V  (15 unrouted)
  Top 0.305: U10.6 58.24,109.27 C22.1 | U11.6 65.24,109.27 C23.1 | U9.6 72.24,109.27 C19.1 | U8.6 79.24,109.27 C15.1 | U7.6 86.24,109.27 C16.1 85.51,110 | U6.6 93.24,109.27 C17.1 | U5.6 99.74,109.27 C20.1 | U4.6 107.24,109.27 C21.1 106.51,110 | U3.6 114.74,109.27 C18.1
+24V  (via drill 2 pad 3.81)  (4 unrouted)
  other vias: 22.01,165.5 22.01,161.5 40.01,165.5 40.01,161.5 58.01,165.5 58.01,161.5 166.01,165.5 166.01,161.5 148.01,165.5 148.01,161.5 130.01,165.5 130.01,161.5 112.01,165.5 112.01,161.5 94.01,165.5 94.01,161.5 76.01,165.5 76.01,161.5 22.01,169.5 40.01,169.5 58.01,157.5 76.01,169.5 94.01,169.5 112.01,157.5 130.01,169.5 148.01,169.5 166.01,157.5 27.51,105.5 31.51,105.5 35.51,105.5 27.51,101.5 31.51,101.5 35.51,101.5 17.51,106 17.51,102 45.01,105.5 49.01,105.5 45.01,101.5 49.01,101.5 13.51,106 9.51,106
  pour Bottom (isolate 1.016): 174.76,98.5 -0.99,98.5 -1.49,176.5 177.01,176.5 177.51,99.25 176.26,98.75
  pour Top (isolate 1.016, no thermals): 16.51,174 16.51,159.75 16.51,159.5 24.01,159.5 24.01,175.25 16.51,175.25
  pour Top (isolate 1.016, no thermals): 34.51,174 34.51,159.75 34.51,159.5 42.01,159.5 42.01,175.25 34.51,175.25
  pour Top (isolate 1.016, rank 6, no thermals): 52.51,175.25 52.51,159.5 56.01,159.5 56.01,155.5 60.01,155.5 60.01,175.25
  pour Top (isolate 1.016, no thermals): 70.51,174 70.51,159.75 70.51,159.5 78.01,159.5 78.01,175.25 70.51,175.25
  pour Top (isolate 1.016, no thermals): 88.51,174 88.51,159.75 88.51,159.5 96.01,159.5 96.01,175.25 88.51,175.25
  pour Top (isolate 1.016, rank 6, no thermals): 106.51,175.25 106.51,159.5 110.01,159.5 110.01,155.5 114.01,155.5 114.01,175.25
  pour Top (isolate 1.016, no thermals): 124.51,174 124.51,159.75 124.51,159.5 132.01,159.5 132.01,175.25 124.51,175.25
  pour Top (isolate 1.016, no thermals): 142.51,174 142.51,159.75 142.51,159.5 150.01,159.5 150.01,175.25 142.51,175.25
  pour Top (isolate 1.016, no thermals): 160.51,175.25 160.51,159.5 164.01,159.5 164.01,155.5 168.01,155.5 168.01,175.25
AD1_AIN0
  Top 0.254: U12.11 19.26,18 17.76,16.5 17.76,4.67 K17.4
AD1_AIN1  (via drill 0.3 pad 0.5)
  Top 0.254: C54.1 14.03,9.88 | 14.03,9.88 R37.1 | 14.03,9.88 14.03,11.6 C51.2 | U12.12 19.86,17.35 v19.01,16.5 | C51.2 14.01,12 | v16.76,16.5 16.76,16 arc-90 16.38,15.62 15.37,15.62 arc90 14.99,15.24 14.99,15.16 arc90 15.37,14.78 16.38,14.78 arc-90 16.76,14.39 16.76,14.31 arc-90 16.38,13.93 15.37,13.93 arc90 14.99,13.55 14.99,13.47 arc90 15.37,13.09 16.38,13.09 arc-90 16.76,12.71 16.76,12.5 16.26,12 C51.2
  Bottom 0.254: v19.01,16.5 v19.01,16.5 arc90 18.63,16.12 18.63,15.38 arc-90 18.25,15 17.52,15 arc-90 17.14,15.38 17.14,16.12 arc90 v16.76,16.5
AD1_AIN2  (via drill 0.3 pad 0.5)
  Top 0.254: C57.2 11.48,9.88 R38.1 11.51,11.62 | 11.51,11.62 C51.1 | U12.17 25.11,17.35 v25.01,17.25 | v15.76,17.25 11.51,13 11.51,11.62
  Bottom 0.254: v25.01,17.25 v15.76,17.25
AD1_AIN3
  Top 0.254: K18.4 28.26,3.5 28.26,5 28.34,11.42 23.76,16 23.76,17.5 24.26,18 U12.18
AD1_AIN4
  Top 0.254: C55.1 25.03,9.88 R39.1 25.01,11.5 25.01,11.62 | 25.01,11.62 C52.2 24.51,12.12 24.63,12.12 | 25.01,11.62 25.01,13.5 21.76,16.75 21.01,16.75 U12.13
AD1_AIN5
  Top 0.254: C58.2 22.48,9.88 R40.1 22.51,11.62 C52.1 20.51,12 20.26,12.25 20.26,13 arc-90 20.64,13.38 21.46,13.38 arc90 21.84,13.76 21.84,14.5 arc90 21.46,14.88 20.64,14.88 arc-90 20.26,15.26 20.26,16 20.91,16 U12.14
AD1_AIN6  (via drill 0.3 pad 0.5)
  Top 0.254: C53.2 36.01,11.62 R41.1 37.48,9.85 C56.1 | 36.01,12 C53.2 | 36.01,11.75 36.01,12.25 35.76,12 C53.2 | U12.15 26.76,15.85 v26.76,15.25 | C53.2 36.01,12.38 35.38,12.38 v32.51,15.25
  Bottom 0.254: v32.51,15.25 v26.76,15.25
AD1_AIN7
  Top 0.254: C59.2 33.48,9.88 | 33.48,9.88 R42.1 | 33.48,9.88 33.48,11.6 C53.1 32.32,13.56 arc90 31.78,13.56 31.63,13.41 arc-90 31.1,13.41 31.06,13.45 arc-90 31.06,13.99 31.21,14.14 arc90 31.21,14.68 31.17,14.72 arc90 30.63,14.72 30.48,14.57 arc-90 29.94,14.57 29.9,14.61 arc-90 29.9,15.14 30.05,15.29 arc90 30.05,15.83 29.18,16.7 U12.16
AD2_AIN0
  Top 0.254: U13.11 52.26,18 50.76,16.5 50.76,4.67 K20.4
AD2_AIN1  (via drill 0.3 pad 0.5)
  Top 0.254: C63.1 47.03,9.88 | 47.03,9.88 R43.1 | 47.03,9.88 47.03,11.35 C60.2 46.63,12 49.26,12 49.76,12.5 49.76,12.71 arc90 49.38,13.09 48.37,13.09 arc-90 47.99,13.47 47.99,13.55 arc-90 48.37,13.93 49.38,13.93 arc90 49.76,14.31 49.76,14.39 arc90 49.38,14.78 48.37,14.78 arc-90 47.99,15.16 47.99,15.24 arc-90 48.37,15.62 49.38,15.62 arc90 49.76,16 v49.76,16.5 | U13.12 52.86,17.35 v52.01,16.5
  Bottom 0.254: v52.01,16.5 v52.01,16.5 arc90 51.63,16.12 51.63,15.38 arc-90 51.25,15 50.52,15 arc-90 50.14,15.38 50.14,16.12 arc90 v49.76,16.5
AD2_AIN2  (via drill 0.3 pad 0.5)
  Top 0.254: C66.2 44.48,9.88 R44.1 44.51,11.25 44.51,11.38 | 44.51,11.38 C60.1 | U13.17 58.11,17.35 v58.01,17.25 | v48.76,17.25 44.51,13 44.51,11.38
  Bottom 0.254: v58.01,17.25 v48.76,17.25
AD2_AIN3
  Top 0.254: U13.18 57.26,18 56.76,17.5 56.76,16 61.34,11.42 61.26,5 61.26,4.17 K21.4
AD2_AIN4
  Top 0.254: C64.1 58.03,9.88 R45.1 58.01,11.12 C61.2 57.76,11.62 58.01,11.62 58.01,13.5 54.76,16.75 54.01,16.75 U13.13
AD2_AIN5
  Top 0.254: C67.2 55.48,9.88 R46.1 55.51,11.12 C61.1 55.88,12 53.51,12 53.26,12.25 53.26,13 arc-90 53.64,13.38 54.46,13.38 arc90 54.84,13.76 54.84,14.5 arc90 54.46,14.88 53.64,14.88 arc-90 53.26,15.26 53.26,16 53.91,16 U13.14
AD2_AIN6  (via drill 0.3 pad 0.5)
  Top 0.254: C65.1 69.03,9.88 R47.1 69.01,11.12 C62.2 68.38,11.75 68.38,12.38 v65.51,15.25 | U13.15 59.76,15.85 v59.76,15.25
  Bottom 0.254: v65.51,15.25 v59.76,15.25
AD2_AIN7
  Top 0.254: C68.2 66.48,9.88 R48.1 66.51,11.12 C62.1 66.88,12 65.32,13.56 arc90 64.78,13.56 64.63,13.41 arc-90 64.1,13.41 64.06,13.45 arc-90 64.06,13.99 64.21,14.14 arc90 64.21,14.68 64.17,14.72 arc90 63.63,14.72 63.48,14.57 arc-90 62.94,14.57 62.9,14.61 arc-90 62.9,15.14 63.05,15.29 arc90 63.05,15.83 62.18,16.7 U13.16
AD3_AIN0
  Top 0.254: U14.11 85.26,18 83.76,16.5 83.76,4.67 K23.4
AD3_AIN1  (via drill 0.3 pad 0.5)
  Top 0.254: C72.1 80.03,9.88 R49.1 80.01,11.12 C69.2 79.63,12 82.26,12 82.76,12.5 82.76,12.71 arc90 82.38,13.09 81.37,13.09 arc-90 80.99,13.47 80.99,13.55 arc-90 81.37,13.93 82.38,13.93 arc90 82.76,14.31 82.76,14.39 arc90 82.38,14.78 81.37,14.78 arc-90 80.99,15.16 80.99,15.24 arc-90 81.37,15.62 82.38,15.62 arc90 82.76,16 v82.76,16.5 | U14.12 85.86,17.35 v85.01,16.5
  Bottom 0.254: v85.01,16.5 v85.01,16.5 arc90 84.63,16.12 84.63,15.38 arc-90 84.25,15 83.52,15 arc-90 83.14,15.38 83.14,16.12 arc90 v82.76,16.5
AD3_AIN2  (via drill 0.3 pad 0.5)
  Top 0.254: C75.2 77.48,9.88 R50.1 77.51,11.12 C69.1 77.76,11.62 77.51,11.62 77.51,13 v81.76,17.25 | U14.17 91.11,17.35 v91.01,17.25
  Bottom 0.254: v91.01,17.25 v81.76,17.25
AD3_AIN3
  Top 0.254: U14.18 90.26,18 89.76,17.5 89.76,16 94.34,11.42 94.26,5 94.26,4.17 K24.4
AD3_AIN4
  Top 0.254: C73.1 91.03,9.88 R51.1 91.01,11.12 C70.2 90.76,11.62 91.01,11.62 91.01,13.5 87.76,16.75 87.01,16.75 U14.13
AD3_AIN5
  Top 0.254: C76.2 87.03,9.85 R52.1 88.51,11.12 C70.1 88.88,12 86.51,12 86.26,12.25 86.26,13 arc-90 86.64,13.38 87.46,13.38 arc90 87.84,13.76 87.84,14.5 arc90 87.46,14.88 86.64,14.88 arc-90 86.26,15.26 86.26,16 86.91,16 U14.14
AD3_AIN6  (via drill 0.3 pad 0.5)
  Top 0.254: C74.1 102.03,9.88 R53.1 102.01,11.12 C71.2 101.38,11.75 101.38,12.38 v98.51,15.25 | U14.15 92.76,15.85 v92.76,15.25
  Bottom 0.254: v98.51,15.25 v92.76,15.25
AD3_AIN7
  Top 0.254: C77.2 99.48,9.88 | 99.48,9.88 R54.1 | 99.48,9.88 99.48,11.1 C71.1 99.88,12 98.32,13.56 arc90 97.78,13.56 97.63,13.41 arc-90 97.1,13.41 97.06,13.45 arc-90 97.06,13.99 97.21,14.14 arc90 97.21,14.68 97.17,14.72 arc90 96.63,14.72 96.48,14.57 arc-90 95.94,14.57 95.9,14.61 arc-90 95.9,15.14 96.05,15.29 arc90 96.05,15.83 95.18,16.7 U14.16
ADC_5V  (15 unrouted)
  Top 0.254: C36.1 29.53,20.6 U12.22 | C33.1 22.88,25.38 22.01,24.5 U12.1 18.61,24.5 R19.2 | C34.1 55.88,25.38 55.01,24.5 U13.1 51.61,24.5 R20.2 | C35.1 88.88,25.38 88.01,24.5 U14.1 84.61,24.5 R21.2
AGND  (2 unrouted)
  pour Top (isolate 1.016, rank 6, no thermals): -0.49,175.5 176.51,175 176.01,92 53.01,92 53.01,87.5 53.01,86.5 12.51,86.5 12.51,91.5 -0.99,91.5 -0.99,175.5
BIASP_AD1
  Top 0.254: K19.1 30.97,2.96 30.01,2 21.47,2 K18.1 19.97,3.46 18.51,2 10.47,2 K17.1 8.97,3.54 7.51,5 7.51,16.1 7.51,18.75 11.11,22.35 R34.2 12.76,22.35 R28.1
BIASP_AD2  (2 unrouted)
  Top 0.254: R30.1 45.76,22.35 R35.2 44.11,22.35 40.51,18.75 40.51,4.96 K20.1
BIASP_AD3  (2 unrouted)
  Top 0.254: R32.1 78.76,22.35 R36.2 77.11,22.35 73.51,18.75 73.51,4.96 K23.1
EXTGPIO_!INT  (2 unrouted)
GND  (via drill 0.3 pad 0.5)  (172 unrouted)
  Top 0.254: U12.2 22.16,23.85 22.26,23.75 22.26,23.5 21.96,23.2 U12.3 | U12.21 25.06,19.95 v25.01,20 | U12.10 19.36,18.65 v19.26,18.75 | C36.2 v33.26,19.75 | C33.2 v25.76,26.25 | C42.1 v11.76,24.5 | 12.88,20.48 R29.1 | U13.2 55.16,23.85 55.26,23.75 55.26,23.5 54.96,23.2 U13.3 | U13.21 58.06,19.95 v58.01,20 | U13.10 52.36,18.65 v52.26,18.75 | C37.2 v66.26,19.75 | C34.2 v58.76,26.25 | C45.1 v44.76,24.5 | 44.41,20.5 R35.1 | 45.88,20.48 R31.1 | U14.2 88.16,23.85 88.26,23.75 88.26,23.5 87.96,23.2 U14.3 | U14.21 91.06,19.95 v91.01,20 | U14.10 85.36,18.65 v85.26,18.75 | C38.2 v99.26,19.75 | C35.2 v91.76,26.25 | C48.1 v77.76,24.5 | 77.41,20.5 R36.1 | 78.88,20.48 R33.1
  Top 0.305: 60.78,109.27 C22.2 | 67.78,109.27 C23.2 | 74.78,109.27 C19.2 | 81.78,109.27 C15.2 | 88.78,109.27 C16.2 | 95.78,109.27 C17.2 | 102.28,109.27 C20.2 | 109.78,109.27 C21.2 | 117.28,109.27 C18.2
  other vias: 9.51,7 16.01,7 11.76,19.5 44.76,19.5 77.76,19.5
GND1  (via drill 0.3 pad 0.5)  (1 unrouted)
  other vias: 20.51,7 26.51,7
GND2  (via drill 0.3 pad 0.5)  (1 unrouted)
  other vias: 32.01,7 37.51,7
GND3  (via drill 0.3 pad 0.5)  (1 unrouted)
  other vias: 43.01,7 48.51,7
GND4  (via drill 0.3 pad 0.5)  (1 unrouted)
  other vias: 54.01,7 59.51,7
GND5  (via drill 0.3 pad 0.5)  (1 unrouted)
  other vias: 65.01,7 70.51,7
GND6  (via drill 0.3 pad 0.5)  (1 unrouted)
  other vias: 76.01,7 81.51,7
GND7  (via drill 0.3 pad 0.5)  (1 unrouted)
  other vias: 87.01,7 92.51,7
GND8  (via drill 0.3 pad 0.5)  (1 unrouted)
  other vias: 98.01,7 103.51,7
GPIO0.0  (1 unrouted)
  Top 0.254: R79.1 110.53,6.85 C86.2
GPIO0.1  (1 unrouted)
  Top 0.254: R81.1 120.53,6.85 C87.2
GPIO0.2  (1 unrouted)
  Top 0.254: R83.1 130.53,6.85 C88.2
GPIO0.3  (1 unrouted)
  Top 0.254: R85.1 140.53,6.85 C89.2
GPIO0.4  (1 unrouted)
  Top 0.254: R87.1 150.53,6.85 C90.2
GPIO0.5  (1 unrouted)
  Top 0.254: R89.1 160.53,6.85 C91.2
GPIO0.6_OUT  (1 unrouted)
GPIO0.7_OUT  (1 unrouted)
GPIO1.6_IN  (2 unrouted)
GPIO1.7_IN  (2 unrouted)
GPIO6_OUT  (1 unrouted)
GPIO7_OUT  (1 unrouted)
IEXC1_AD1
  Top 0.254: U12.20 26.61,19.25 28.26,19.25 28.76,18.75 33.01,18.75 39.26,12.5 39.26,4.17 K19.4
IEXC1_AD2
  Top 0.254: U13.20 59.61,19.25 61.26,19.25 61.76,18.75 66.01,18.75 72.26,12.5 72.26,4.17 K22.4
IEXC1_AD3
  Top 0.254: U14.20 92.61,19.25 94.26,19.25 94.76,18.75 99.01,18.75 105.26,12.5 105.26,4.17 K25.4
IIC1_SCL  (4 unrouted)
IIC1_SDA  (4 unrouted)
LED1  (1 unrouted)
MISO  (5 unrouted)
  Top 0.406: R22.4 33.95,23.94 34.26,24.25 | R24.4 66.95,23.94 67.26,24.25 | R26.4 99.95,23.94 100.26,24.25
MOSI  (5 unrouted)
  Top 0.406: R23.1 34.32,25.56 34.76,26 | R25.1 67.32,25.56 67.76,26 | R27.1 100.32,25.56 100.76,26
N$1  (1 unrouted)
N$2  (1 unrouted)
N$3
  pour Top (isolate 1.016, rank 5, no thermals): 152.76,174.75 152.76,148.75 161.01,148.75 161.01,155.5 161.01,156.5 159.51,158 158.51,159 158.51,174.75
  pour Top (isolate 1.016, rank 5, no thermals): 161.51,123.5 161.51,148.5 161.01,149 161.11,153.66 168.01,153.66 168.01,123.5
N$4  (1 unrouted)
N$5  (1 unrouted)
N$6
  pour Top (isolate 1.016, rank 5, no thermals): 134.76,174.75 134.76,148.75 143.01,148.75 143.01,155.5 143.01,156.5 141.51,158 140.51,159 140.51,174.75
  pour Top (isolate 1.016, rank 5, no thermals): 143.51,123.5 143.51,148.5 143.01,149 143.11,156.66 150.01,156.66 150.01,123.5
N$7  (1 unrouted)
N$8
  pour Top (isolate 1.016, rank 5, no thermals): 116.76,174.75 116.76,148.75 125.01,148.75 125.01,155.5 125.01,156.5 123.51,158 122.51,159 122.51,174.75
  pour Top (isolate 1.016, rank 5, no thermals): 125.51,123.5 125.51,148.5 125.01,149 125.11,156.66 132.01,156.66 132.01,123.5
N$9  (1 unrouted)
N$10  (1 unrouted)
N$11
  pour Top (isolate 1.016, no thermals): 98.76,174.75 98.76,148.75 107.01,148.75 107.01,155.5 107.01,156.5 105.51,158 104.51,159 104.51,174.75
  pour Top (isolate 1.016, rank 5, no thermals): 107.51,123.5 107.51,148.5 107.01,149 107.11,153.66 114.01,153.66 114.01,123.5
N$12  (1 unrouted)
N$13
  pour Top (isolate 1.016, rank 5, no thermals): 80.76,174.75 80.76,148.75 89.01,148.75 89.01,155.5 89.01,156.5 87.51,158 86.51,159 86.51,174.75
  pour Top (isolate 1.016, rank 5, no thermals): 89.51,123.5 89.51,148.5 89.01,149 89.11,156.66 96.01,156.66 96.01,123.5
N$14  (1 unrouted)
N$15
  pour Top (isolate 1.016, rank 5, no thermals): 62.76,174.75 62.76,148.75 71.01,148.75 71.01,155.5 71.01,156.5 69.51,158 68.51,159 68.51,174.75
  pour Top (isolate 1.016, rank 5, no thermals): 71.51,123.5 71.51,148.5 71.01,149 71.11,156.66 78.01,156.66 78.01,123.5
N$16  (1 unrouted)
N$17
  pour Top (isolate 1.016, rank 5, no thermals): 44.76,174.75 44.76,148.75 53.01,148.75 53.01,155.5 53.01,156.5 51.51,158 50.51,159 50.51,174.75
  pour Top (isolate 1.016, rank 5, no thermals): 53.51,123.5 53.51,148.5 53.01,149 53.11,154.16 60.01,154.16 60.01,123.5
N$18
  pour Top (isolate 1.016, rank 5, no thermals): 8.76,175 8.76,149 17.01,149 17.01,155.75 17.01,156.75 15.51,158.25 14.51,159.25 14.51,175
  pour Top (isolate 1.016, rank 5, no thermals): 17.51,127 17.51,148.5 17.01,149 17.11,156.66 24.01,156.66 24.01,127
N$19
  pour Top (isolate 1.016, rank 5, no thermals): 26.76,174.75 26.76,148.75 35.01,148.75 35.01,155.5 35.01,156.5 33.51,158 32.51,159 32.51,174.75
  pour Top (isolate 1.016, rank 5, no thermals): 35.51,127 35.51,148.5 35.01,149 35.11,156.66 42.01,156.66 42.01,127
N$20
  Top 0.254: R39.2 25.01,3.54 K18.3
N$21  (1 unrouted)
N$22
  Top 0.254: R40.2 K18.2
N$23
  Top 0.254: R37.2 14.01,3.54 K17.3
N$24  (1 unrouted)
N$25  (1 unrouted)
N$26  (1 unrouted)
N$27
  Top 0.254: K17.2 R38.2
N$28
  Top 0.254: R41.2 36.01,3.54 K19.3
N$29  (1 unrouted)
N$30  (1 unrouted)
N$31
  Top 0.254: R42.2 K19.2
N$32  (1 unrouted)
N$33  (1 unrouted)
N$34
  Top 0.254: R43.2 47.01,3.54 K20.3
N$35
  Top 0.254: R44.2 K20.2
N$36  (1 unrouted)
N$37  (1 unrouted)
N$38  (1 unrouted)
N$39  (2 unrouted)
N$40  (2 unrouted)
N$41  (1 unrouted)
N$42
  Top 0.254: R45.2 58.01,3.54 K21.3
N$43
  Top 0.254: R46.2 K21.2
N$44
  Top 0.254: R47.2 69.01,3.54 K22.3
N$45
  Top 0.254: R48.2 K22.2
N$46
  Top 0.254: R49.2 80.01,3.54 K23.3
N$47  (1 unrouted)
N$48
  Top 0.254: R50.2 K23.2
N$49
  Top 0.254: R51.2 91.01,3.54 K24.3
N$50
  Top 0.254: R52.2 K24.2
N$51
  Top 0.254: R53.2 102.01,3.54 K25.3
N$52
  Top 0.254: R54.2 K25.2
N$53  (1 unrouted)
N$54  (1 unrouted)
N$55  (1 unrouted)
N$56  (2 unrouted)
N$57  (2 unrouted)
N$58  (2 unrouted)
N$59  (1 unrouted)
N$60  (1 unrouted)
N$61  (1 unrouted)
N$62  (1 unrouted)
N$63  (1 unrouted)
N$64  (via drill 0.35 pad 0.61)  (1 unrouted)
  Top 0.254: R79.2 R78.2 114.18,4.83 SW1.3 114.16,2.75 v112.51,2.75
  Bottom 0.254: X1.2 v112.51,2.75
N$66  (via drill 0.35 pad 0.61)  (1 unrouted)
  Top 0.254: R81.2 R80.2 124.18,4.83 SW3.3 124.16,2.75 v122.51,2.75
  Bottom 0.254: X2.2 v122.51,2.75
N$68  (via drill 0.35 pad 0.61)  (1 unrouted)
  Top 0.254: R83.2 R82.2 134.18,4.83 SW4.3 134.16,2.75 v132.51,2.75
  Bottom 0.254: v132.51,2.75 X3.2
N$70  (via drill 0.35 pad 0.61)  (1 unrouted)
  Top 0.254: R85.2 R84.2 144.18,4.83 SW5.3 144.16,2.75 v142.51,2.75
  Bottom 0.254: X4.2 v142.51,2.75
N$72  (via drill 0.35 pad 0.61)  (1 unrouted)
  Top 0.254: R87.2 R86.2 154.18,4.83 SW6.3 154.16,2.75 v152.51,2.75
  Bottom 0.254: X5.2 v152.51,2.75
N$79  (via drill 0.35 pad 0.61)  (1 unrouted)
  Top 0.254: R89.2 R88.2 164.18,4.83 SW7.3 164.16,2.75 v162.51,2.75
  Bottom 0.254: X6.2 v162.51,2.75
N$88  (1 unrouted)
N$89  (1 unrouted)
N$90  (1 unrouted)
N$91  (1 unrouted)
N$92  (1 unrouted)
N$93  (1 unrouted)
N$94  (1 unrouted)
N$95  (1 unrouted)
N$96  (1 unrouted)
N$97  (1 unrouted)
N$98  (1 unrouted)
N$99  (1 unrouted)
N$100  (1 unrouted)
N$101  (1 unrouted)
N$102  (1 unrouted)
N$103  (1 unrouted)
N$104  (1 unrouted)
N$105  (1 unrouted)
N$106  (1 unrouted)
N$107  (1 unrouted)
N$108  (1 unrouted)
PWM_DOT1  (1 unrouted)
PWM_DOT2  (1 unrouted)
PWM_SEG1  (1 unrouted)
PWM_SEG2  (1 unrouted)
PWM_SEG3  (1 unrouted)
PWM_SEG4  (1 unrouted)
PWM_SEG5  (1 unrouted)
PWM_SEG6  (1 unrouted)
PWM_SEG7  (1 unrouted)
REFN0_AD1
  Top 0.254: U12.6 16.88,21.25 C43.2 14.73,20.62 R29.2 14.61,18.77 C44.1
REFN0_AD2
  Top 0.254: U13.6 49.88,21.25 C46.2 47.73,20.62 R31.2 47.61,18.77 C47.1
REFN0_AD3
  Top 0.254: U14.6 82.88,21.25 C49.2 80.73,20.62 R33.2 80.61,18.77 C50.1
REFP0_AD1
  Top 0.254: U12.5 16.73,21.9 C43.1 16.13,22.5 R28.2 14.61,24.48 C42.2
REFP0_AD2
  Top 0.254: U13.5 49.73,21.9 C46.1 49.13,22.5 R30.2 47.61,24.48 C45.2
REFP0_AD3
  Top 0.254: U14.5 82.73,21.9 C49.1 82.13,22.5 R32.2 80.61,24.48 C48.2
RS485+  (2 unrouted)
RS485-  (2 unrouted)
RTC_1HZ_CLK  (3 unrouted)
SCK  (5 unrouted)
  Top 0.406: R23.2 34.1,26.34 34.51,26.75 | R25.2 67.1,26.34 67.51,26.75 | R27.2 100.1,26.34 100.51,26.75
START_AD1  (1 unrouted)
  Top 0.406: R22.1 34.38,21.56 33.9,21.54
START_AD2  (1 unrouted)
  Top 0.406: R24.1 67.38,21.56 66.9,21.54
START_AD3  (1 unrouted)
  Top 0.406: R26.1 100.38,21.56 99.9,21.54
TCK  (1 unrouted)
TDI  (1 unrouted)
TDO  (1 unrouted)
TMS  (1 unrouted)
UART_DE  (1 unrouted)
UART_RX  (2 unrouted)
UART_TX  (2 unrouted)
VO  (1 unrouted)
VO1  (1 unrouted)
VO2  (1 unrouted)
VO3  (1 unrouted)
VO4  (1 unrouted)
VO5  (1 unrouted)
VO6  (1 unrouted)
VO7  (1 unrouted)
VO8  (1 unrouted)
X1  (1 unrouted)